# EAGLE schematic Capstone Schematic (EAGLE 8.5.0)
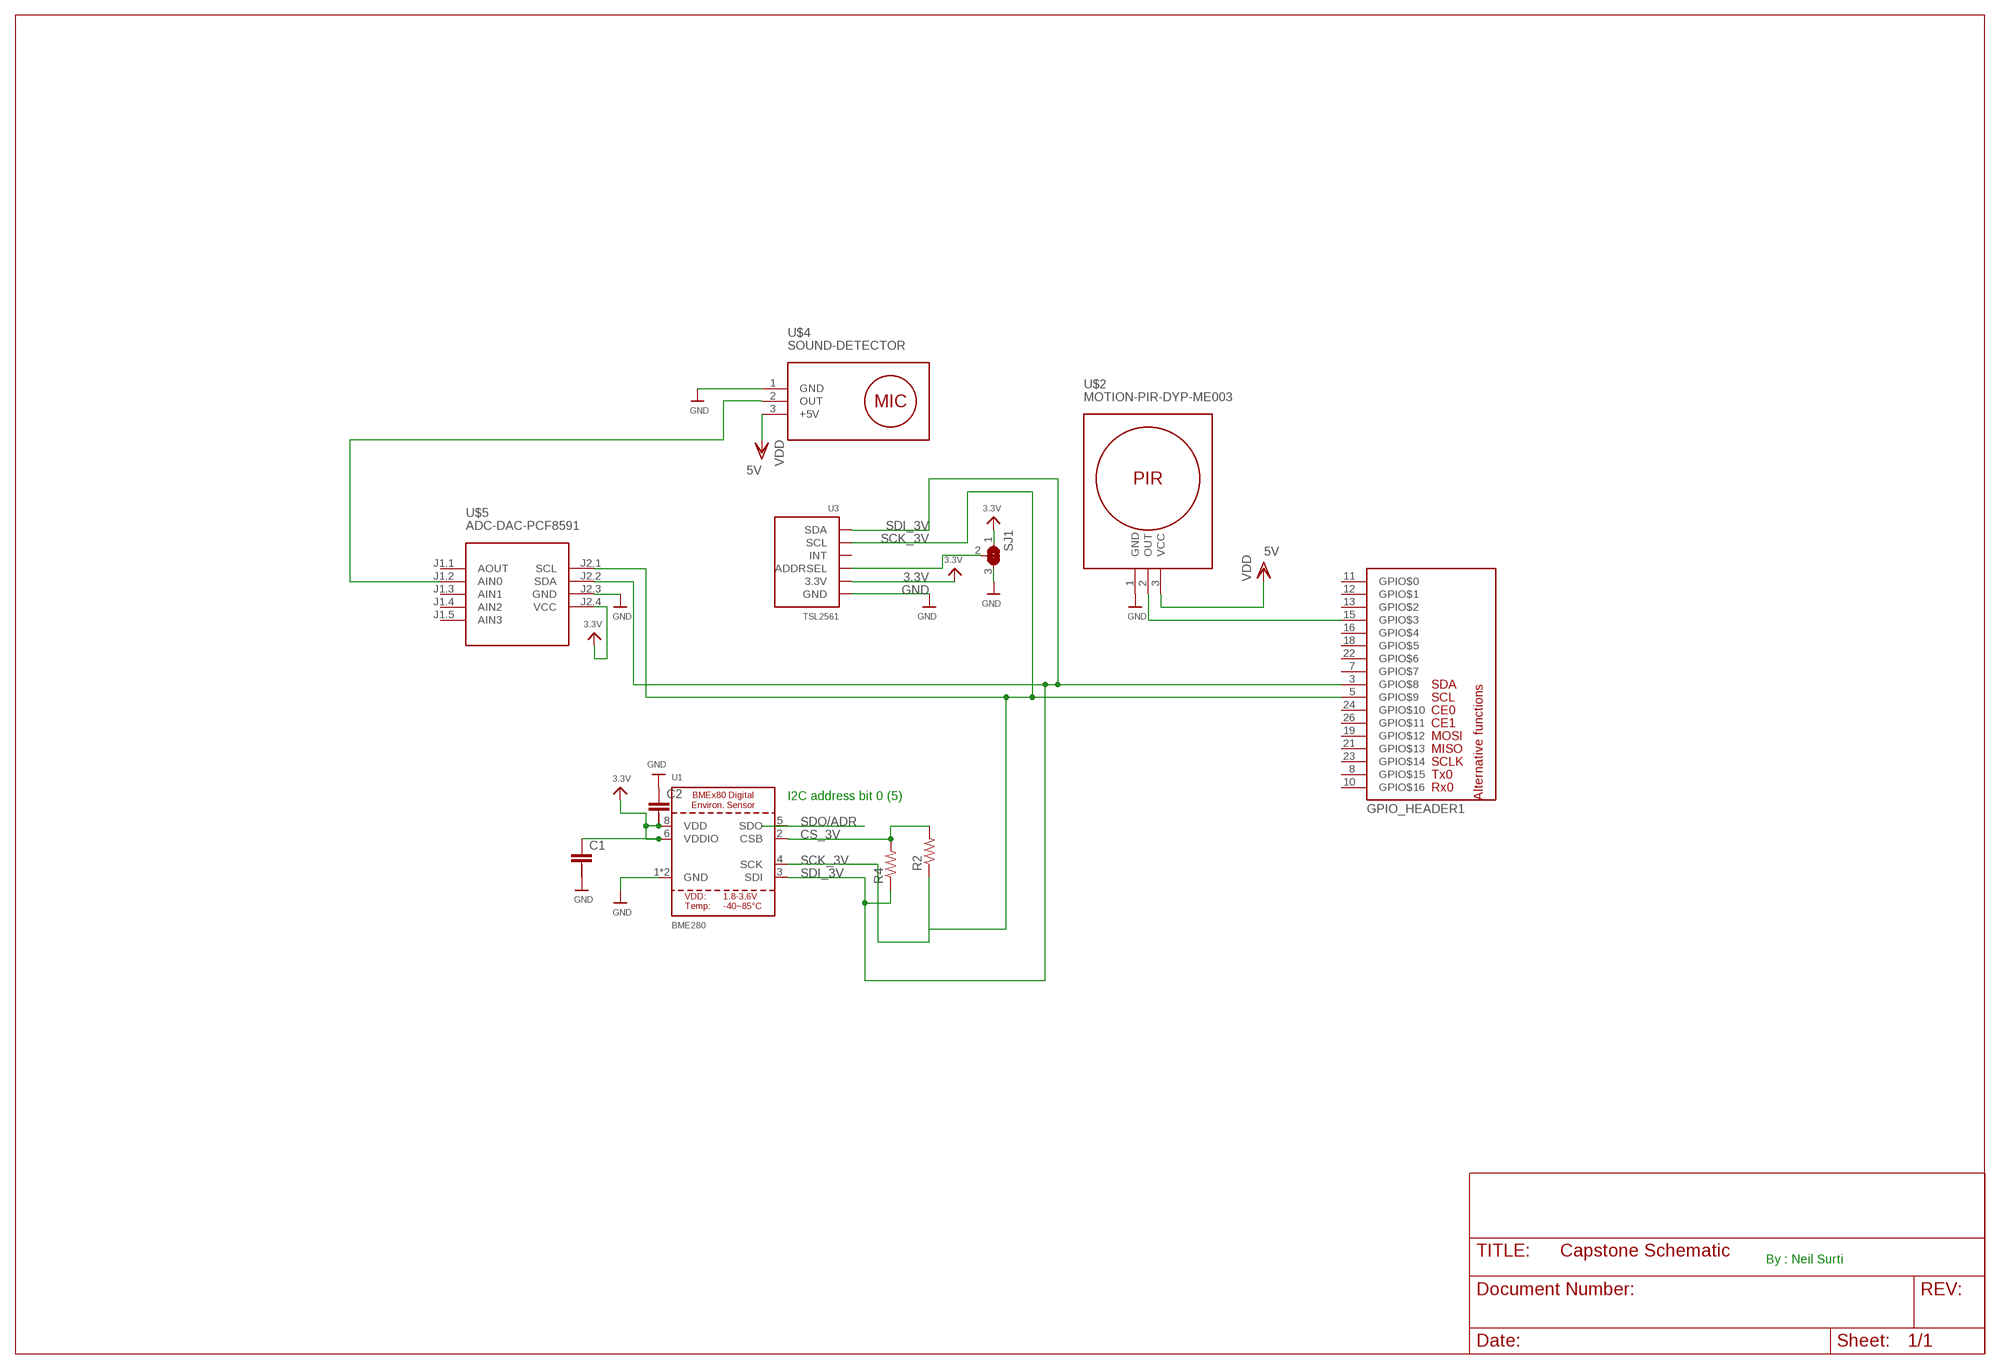
[diagram p0: schematic, sheet 1]

## Parts
C1  C-10-15/6  [C10-15B6]
C2  C-10-15/6  [C10-15B6]
GPIO_HEADER1  RPI_GPIO_HEADER  [2X13]
R2  R-US_0309/12  [0309/12]
R4  R-US_0309/12  [0309/12]
SJ1  SOLDERJUMPER_2WAY  [SOLDERJUMPER_2WAY_OPEN_NOPASTE]
U1  BME280  [BME280]
U3  TSL2561  LIGHT_TSL2561  [TSL2561_FN]
U$2  MOTION-PIR-DYP-ME003  [MOTION-PIR-DYP-ME003]
U$4  SOUND-DETECTOR  [SOUND-DETECTOR]
U$5  ADC-DAC-PCF8591  [ADC-DAC-PCF8591]

## Nets
3.3V: C1.1 C2.2 SJ1.1 U1.6(VDDIO) U1.8(VDD) U3.VDD(3.3V) U$5.J2.4(VCC)
CS_3V: R2.2 R4.2 U1.2(CSB)
GND: C2.1 SJ1.3 U1.1(GND) U1.7(GND) U3.VSS(GND) U$4.1(GND) U$5.J2.3(GND)
N$1: SJ1.2 U3.ADR(ADDRSEL)
N$2: U$4.2(OUT) U$5.J1.2(AIN0)
N$3: GPIO_HEADER1.15(GPIO$3) U$2.2(OUT)
SCK_3V: GPIO_HEADER1.5(GPIO$9) R2.1 U1.4(SCK) U3.CLK(SCL) U$5.J2.1(SCL)
SDI_3V: GPIO_HEADER1.3(GPIO$8) R4.1 U1.3(SDI) U3.DATA(SDA) U$5.J2.2(SDA)
SDO/ADR: U1.5(SDO)
VDD: U$2.3(VCC)
Unconnected: C1.2 C1.3 C2.3 GPIO_HEADER1.7(GPIO$7) GPIO_HEADER1.8(GPIO$15) GPIO_HEADER1.10(GPIO$16) GPIO_HEADER1.11(GPIO$0) GPIO_HEADER1.12(GPIO$1) GPIO_HEADER1.13(GPIO$2) GPIO_HEADER1.16(GPIO$4) GPIO_HEADER1.18(GPIO$5) GPIO_HEADER1.19(GPIO$12) GPIO_HEADER1.21(GPIO$13) GPIO_HEADER1.22(GPIO$6) GPIO_HEADER1.23(GPIO$14) GPIO_HEADER1.24(GPIO$10) GPIO_HEADER1.26(GPIO$11) U3.INT U$5.J1.1(AOUT) U$5.J1.3(AIN1) U$5.J1.4(AIN2) U$5.J1.5(AIN3)

## Notes on the sheet
- I2C address bit 0 (5)
- By : Neil Surti

## Power pins joined to a net without a drawn wire
+3V3: GPIO_HEADER1.1(+3V3) GPIO_HEADER1.17(+3V3)
+5V: GPIO_HEADER1.2(+5V) GPIO_HEADER1.4(+5V) U$4.3(+5V)
GND: GPIO_HEADER1.6(GND) GPIO_HEADER1.9(GND) GPIO_HEADER1.14(GND) GPIO_HEADER1.20(GND) GPIO_HEADER1.25(GND) U$2.1(GND)

## Library data of the parts
C1 C2 = capacitor-wima:C-: CAPACITOR for alternative placement naming: default grid - extended grid/package width
GPIO_HEADER1 = rpi-header:RPI_GPIO_HEADER: Raspberry PI GPIO Header (raspberry pi rev 2). Numbering is taken from WiringPi http://wiringpi.com/pins/ .
R2 R4 = resistor:R-US_: RESISTOR, American symbol
SJ1 = microbuilder:SOLDERJUMPER_2WAY: 2-Way Solder Jumper
U1 = microbuilder:BME280: BME280 - Environmental Sensor (I2C + SPI)
U3 = microbuilder:LIGHT_TSL2561: TSL2561 Light-To-Digital Sensor Mouser Part Numbers: CS (obsolete): 856-TSL2561CS DFN (cheapest): 856-TSL2561FN
U$2 = diy-modules:MOTION-PIR-DYP-ME003: PIR Motion Sensor Module DYP-ME003 based on BISS0001 pyroelectic detector Click here to find device on ebay.com <http://www.ebay.com/sch/dyp+me003>
U$4 = diy-modules:SOUND-DETECTOR: Sound Detection Module
U$5 = diy-modules:ADC-DAC-PCF8591: 4-Channel ADC and 1-Channel DAC Module based on PCF8591 chip More details available here: https://brainfyre.wordpress.com/2012/10/25/pcf8591-yl-40-ad-da-module-review/ Click here to find device on ebay.com <http://www.ebay.com/sch/pcf8591+arduino>